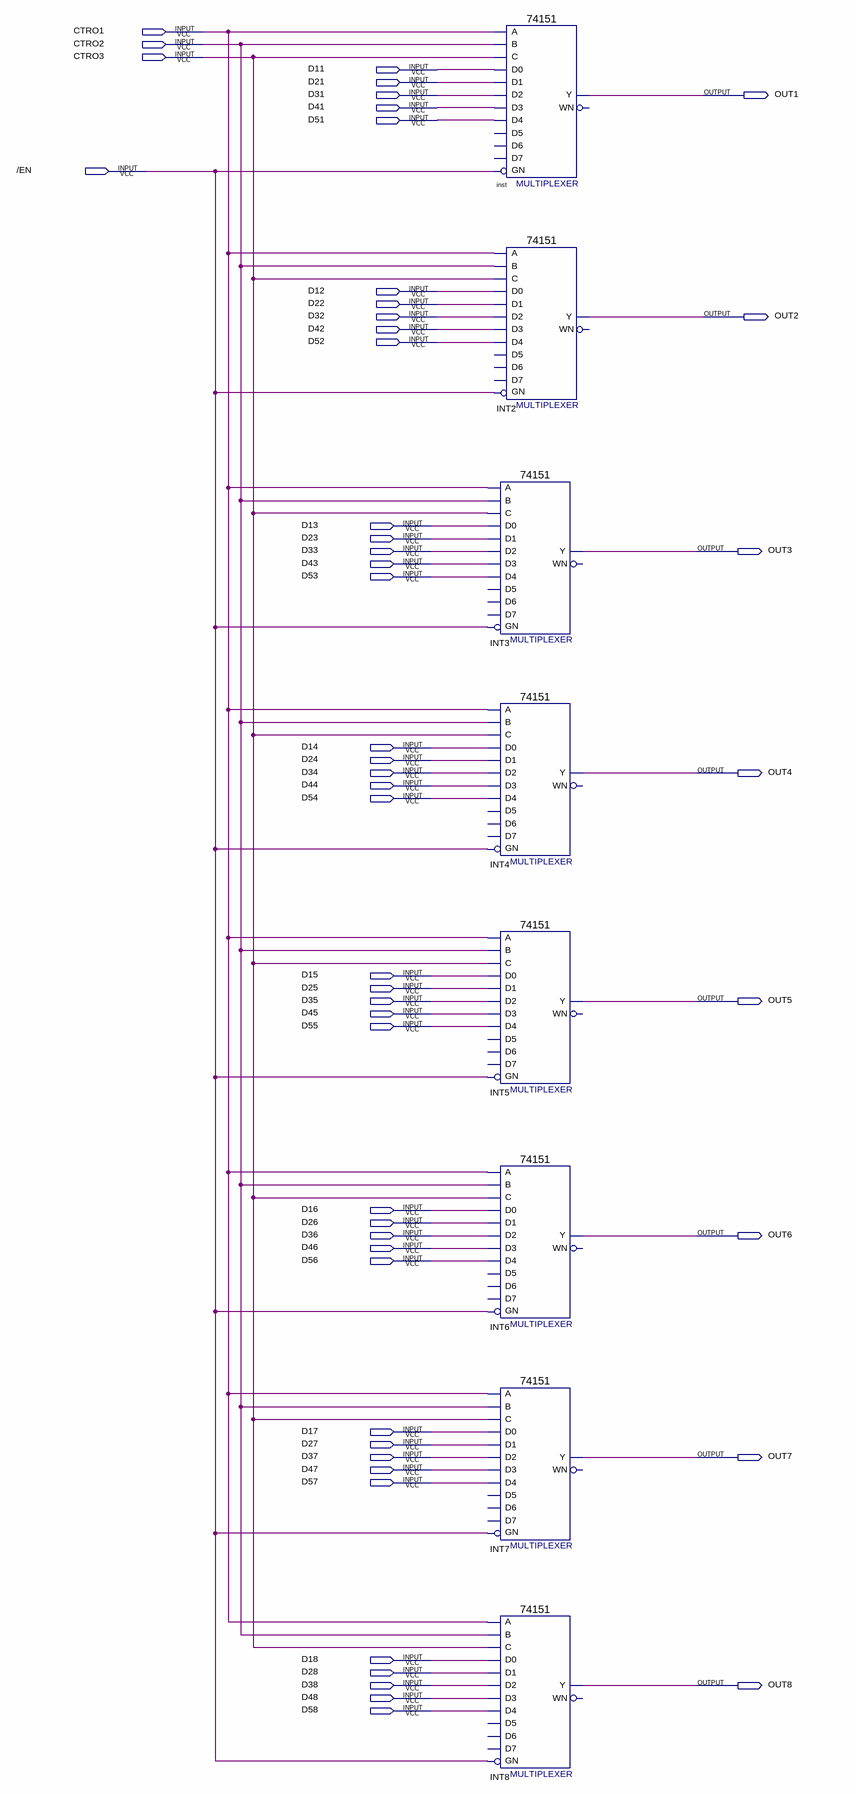
[diagram p0: schematic sheet]
// Quartus schematic SELECT-FIVE.bdf as structural Verilog: 8 symbols, 52 pins
module \SELECT-FIVE  (
  input  CTRO1,
  input  CTRO2,
  input  CTRO3,
  input  D11,
  input  D21,
  input  D31,
  input  D41,
  input  D51,
  input  \/EN ,
  input  D12,
  input  D22,
  input  D32,
  input  D42,
  input  D52,
  input  D13,
  input  D23,
  input  D33,
  input  D43,
  input  D53,
  input  D14,
  input  D24,
  input  D34,
  input  D44,
  input  D54,
  input  D15,
  input  D25,
  input  D35,
  input  D45,
  input  D55,
  input  D16,
  input  D26,
  input  D36,
  input  D46,
  input  D56,
  input  D17,
  input  D27,
  input  D37,
  input  D47,
  input  D57,
  input  D18,
  input  D28,
  input  D38,
  input  D48,
  input  D58,
  output OUT1,
  output OUT2,
  output OUT3,
  output OUT4,
  output OUT5,
  output OUT6,
  output OUT7,
  output OUT8
);

  \74151  inst (
    .GN(\/EN ), .C(CTRO3), .B(CTRO2), .A(CTRO1), .D0(D11), .D1(D21), .D4(D51), .D3(D41), .D2(D31), .Y(OUT1));  // open: D5, D6, D7, WN
  \74151  INT2 (
    .GN(\/EN ), .C(CTRO3), .B(CTRO2), .A(CTRO1), .D0(D12), .D1(D22), .D4(D52), .D3(D42), .D2(D32), .Y(OUT2));  // open: D5, D6, D7, WN
  \74151  INT3 (
    .GN(\/EN ), .C(CTRO3), .B(CTRO2), .A(CTRO1), .D0(D13), .D1(D23), .D4(D53), .D3(D43), .D2(D33), .Y(OUT3));  // open: D5, D6, D7, WN
  \74151  INT4 (
    .GN(\/EN ), .C(CTRO3), .B(CTRO2), .A(CTRO1), .D0(D14), .D1(D24), .D4(D54), .D3(D44), .D2(D34), .Y(OUT4));  // open: D5, D6, D7, WN
  \74151  INT5 (
    .GN(\/EN ), .C(CTRO3), .B(CTRO2), .A(CTRO1), .D0(D15), .D1(D25), .D4(D55), .D3(D45), .D2(D35), .Y(OUT5));  // open: D5, D6, D7, WN
  \74151  INT6 (
    .GN(\/EN ), .C(CTRO3), .B(CTRO2), .A(CTRO1), .D0(D16), .D1(D26), .D4(D56), .D3(D46), .D2(D36), .Y(OUT6));  // open: D5, D6, D7, WN
  \74151  INT7 (
    .GN(\/EN ), .C(CTRO3), .B(CTRO2), .A(CTRO1), .D0(D17), .D1(D27), .D4(D57), .D3(D47), .D2(D37), .Y(OUT7));  // open: D5, D6, D7, WN
  \74151  INT8 (
    .GN(\/EN ), .C(CTRO3), .B(CTRO2), .A(CTRO1), .D0(D18), .D1(D28), .D4(D58), .D3(D48), .D2(D38), .Y(OUT8));  // open: D5, D6, D7, WN
endmodule
